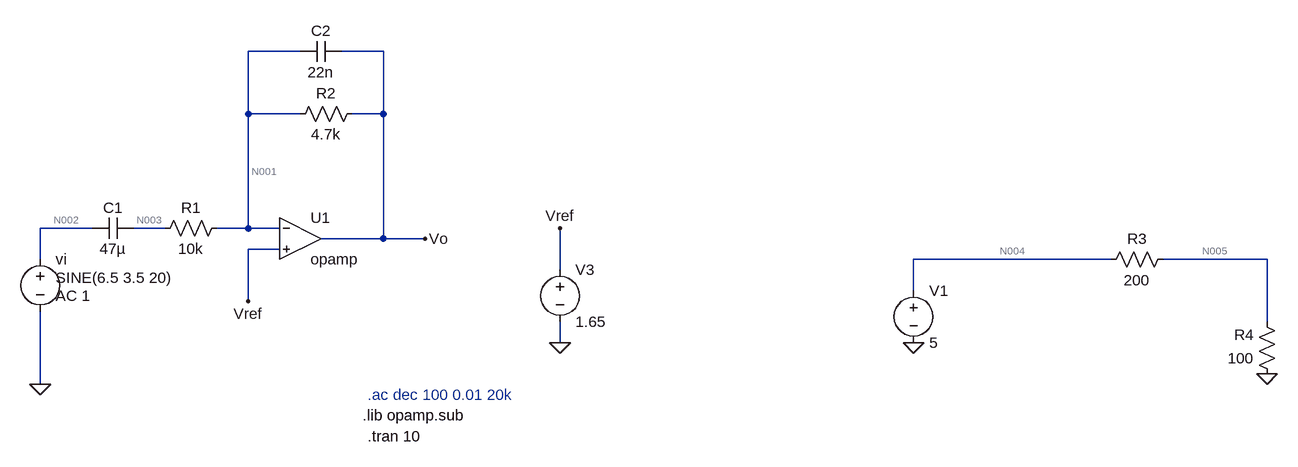
[diagram p0: schematic diseño1.asc]
diseño1.asc, the LTspice schematic file:
Version 4.1
SHEET 1 880 680
WIRE -9504 -3808 -9584 -3808
WIRE -9376 -3808 -9440 -3808
WIRE -9584 -3712 -9584 -3808
WIRE -9504 -3712 -9584 -3712
WIRE -9376 -3712 -9376 -3808
WIRE -9376 -3712 -9424 -3712
WIRE -9824 -3536 -9904 -3536
WIRE -9712 -3536 -9760 -3536
WIRE -9584 -3536 -9584 -3712
WIRE -9584 -3536 -9632 -3536
WIRE -9536 -3536 -9584 -3536
WIRE -9376 -3520 -9376 -3712
WIRE -9376 -3520 -9472 -3520
WIRE -9312 -3520 -9376 -3520
WIRE -9536 -3504 -9584 -3504
WIRE -9904 -3488 -9904 -3536
WIRE -8256 -3488 -8560 -3488
WIRE -8016 -3488 -8176 -3488
WIRE -9104 -3472 -9104 -3536
WIRE -8560 -3440 -8560 -3488
WIRE -9584 -3424 -9584 -3504
WIRE -8016 -3392 -8016 -3488
WIRE -9104 -3360 -9104 -3392
WIRE -9904 -3296 -9904 -3408
FLAG -9312 -3520 Vo
FLAG -9584 -3424 Vref
FLAG -9104 -3360 0
FLAG -9104 -3536 Vref
FLAG -9904 -3296 0
FLAG -8560 -3360 0
FLAG -8016 -3312 0
SYMBOL res -9616 -3552 R90
WINDOW 0 0 56 VBottom 2
WINDOW 3 32 56 VTop 2
SYMATTR InstName R1
SYMATTR Value 10k
SYMBOL res -9408 -3728 R90
WINDOW 0 0 56 VBottom 2
WINDOW 3 32 56 VTop 2
SYMATTR InstName R2
SYMATTR Value 4.7k
SYMBOL cap -9760 -3552 R90
WINDOW 0 0 32 VBottom 2
WINDOW 3 32 32 VTop 2
SYMATTR InstName C1
SYMATTR Value 47µ
SYMBOL cap -9440 -3824 R90
WINDOW 0 0 32 VBottom 2
WINDOW 3 32 32 VTop 2
SYMATTR InstName C2
SYMATTR Value 22n
SYMBOL voltage -9904 -3504 R0
WINDOW 3 24 44 Left 2
WINDOW 123 24 72 Left 2
WINDOW 39 0 0 Left 0
SYMATTR InstName vi
SYMATTR Value SINE(6.5 3.5 20)
SYMATTR Value2 AC 1
SYMBOL voltage -9104 -3488 R0
WINDOW 123 0 0 Left 0
WINDOW 39 0 0 Left 0
SYMATTR InstName V3
SYMATTR Value 1.65
SYMBOL OpAmps\\opamp -9504 -3584 R0
SYMATTR InstName U1
SYMBOL res -8160 -3504 R90
WINDOW 0 0 56 VBottom 2
WINDOW 3 32 56 VTop 2
SYMATTR InstName R3
SYMATTR Value 200
SYMBOL res -8000 -3296 R180
WINDOW 0 36 76 Left 2
WINDOW 3 36 40 Left 2
SYMATTR InstName R4
SYMATTR Value 100
SYMBOL voltage -8560 -3456 R0
WINDOW 123 0 0 Left 0
WINDOW 39 0 0 Left 0
SYMATTR InstName V1
SYMATTR Value 5
TEXT -9400 -3280 Left 2 ;.ac dec 100 0.01 20k
TEXT -9408 -3248 Left 2 !.lib opamp.sub
TEXT -9400 -3216 Left 2 !.tran 10

The netlist it stands for:
* diseño1.asc
R1 N001 N003 10k
R2 Vo N001 4.7k
C1 N003 N002 47µ
C2 Vo N001 22n
vi N002 0 SINE(6.5 3.5 20) AC 1
V3 Vref 0 1.65
X§U1 N001 Vref Vo opamp Aol=100K GBW=10Meg  ; pins invin noninvin out
R3 N005 N004 200
R4 0 N005 100
V1 N004 0 5
* .ac dec 100 0.01 20k
.lib opamp.sub
.tran 10
.backanno
.end

* Results of the author's LTspice run, read from the files saved beside the schematic
* Operating Point, zero values left out:
*   V(n001) = 1.65 V
*   V(n002) = 6.5 V
*   V(n003) = 1.65 V
*   V(n004) = 5 V
*   V(n005) = 1.667 V
*   V(vo) = 1.65 V
*   V(vref) = 1.65 V
*   I(R3) = -16.67 mA
*   I(R4) = -16.67 mA
*   I(V1) = -16.67 mA
*   Ix(u1:3) = 1.275 pA
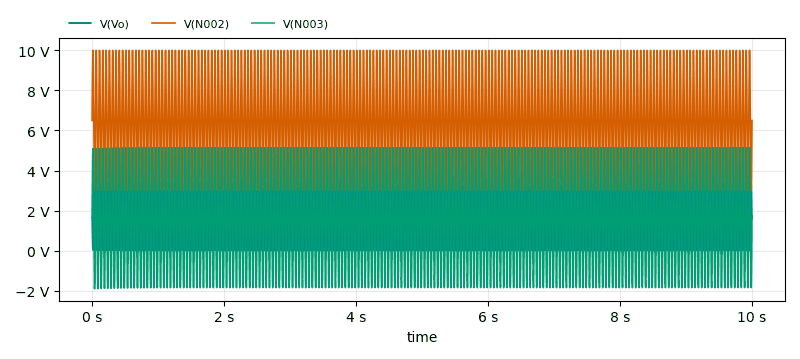
[diagram p1: Transient Analysis of diseño1.asc, plotted from the saved traces]
* Transient Analysis, 1 run:
*   V(Vo): min 6.043 mV, max 3.32 V, average 1.651 V, rms 2.024 V, last 1.644 V
*   V(N002): min 3 V, max 10 V, average 6.502 V, rms 6.962 V, last 6.5 V
*   V(N003): min -1.902 V, max 5.148 V, average 1.647 V, rms 2.985 V, last 1.707 V